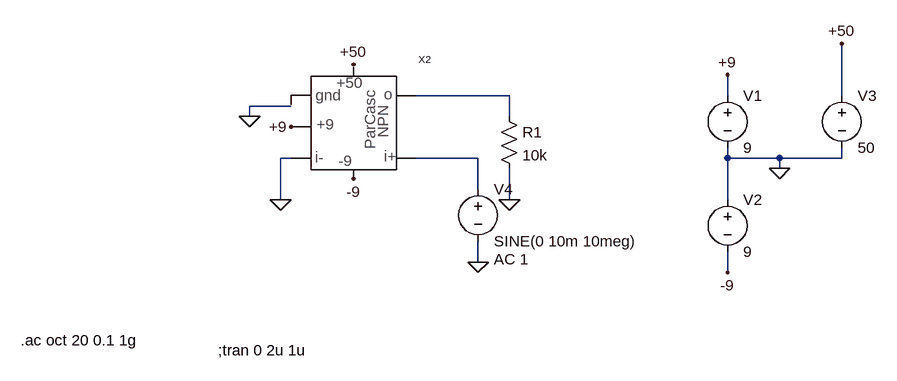
[diagram p0: schematic par-cascode-npn.asc]
par-cascode-npn.asc, the LTspice schematic file:
Version 4
SHEET 1 940 680
WIRE 368 96 224 96
WIRE 704 96 704 64
WIRE 880 96 880 16
WIRE 32 112 -32 112
WIRE -32 128 -32 112
WIRE 368 128 368 96
WIRE 32 192 16 192
WIRE 320 192 224 192
WIRE 704 192 704 176
WIRE 784 192 704 192
WIRE 880 192 880 176
WIRE 880 192 784 192
WIRE 784 208 784 192
WIRE 320 240 320 192
WIRE 16 256 16 192
WIRE 368 256 368 208
WIRE 704 256 704 192
WIRE 320 352 320 320
WIRE 704 368 704 336
FLAG 784 208 0
FLAG 704 64 +9
FLAG 704 368 -9
FLAG 32 144 +9
FLAG 320 352 0
FLAG -32 128 0
FLAG 368 256 0
FLAG 128 224 -9
FLAG 128 48 +50
FLAG 880 16 +50
FLAG 16 256 0
SYMBOL rui\\shortcuts\\voltage 704 80 R0
WINDOW 123 0 0 Left 2
WINDOW 39 0 0 Left 2
SYMATTR InstName V1
SYMATTR Value 9
SYMBOL rui\\shortcuts\\voltage 704 240 R0
WINDOW 123 0 0 Left 2
WINDOW 39 0 0 Left 2
SYMATTR InstName V2
SYMATTR Value 9
SYMBOL rui\\shortcuts\\voltage 880 80 R0
WINDOW 123 0 0 Left 2
WINDOW 39 0 0 Left 2
SYMATTR InstName V3
SYMATTR Value 50
SYMBOL rui\\shortcuts\\voltage 320 224 R0
WINDOW 123 24 124 Left 2
WINDOW 39 0 0 Left 2
SYMATTR Value2 AC 1
SYMATTR InstName V4
SYMATTR Value SINE(0 10m 10meg)
SYMBOL res 352 112 R0
SYMATTR InstName R1
SYMATTR Value 10k
SYMBOL ss-par-cascode-npn 128 128 R0
SYMATTR InstName X2
TEXT -80 488 Left 2 !;tran 0 2u 1u
TEXT -384 472 Left 2 !.ac oct 20 0.1 1g

The netlist it stands for:
* par-cascode-npn.asc
V1 +9 0 9
V2 0 -9 9
V3 +50 0 50
V4 N002 0 SINE(0 10m 10meg) AC 1
R1 N001 0 10k
XX2 0 N002 N001 +50 -9 0 +9 ss-par-cascode-npn  ; pins i- i+ o +50 -9 grnd +9
;tran 0 2u 1u
.ac oct 20 0.1 1g
.backanno
.end